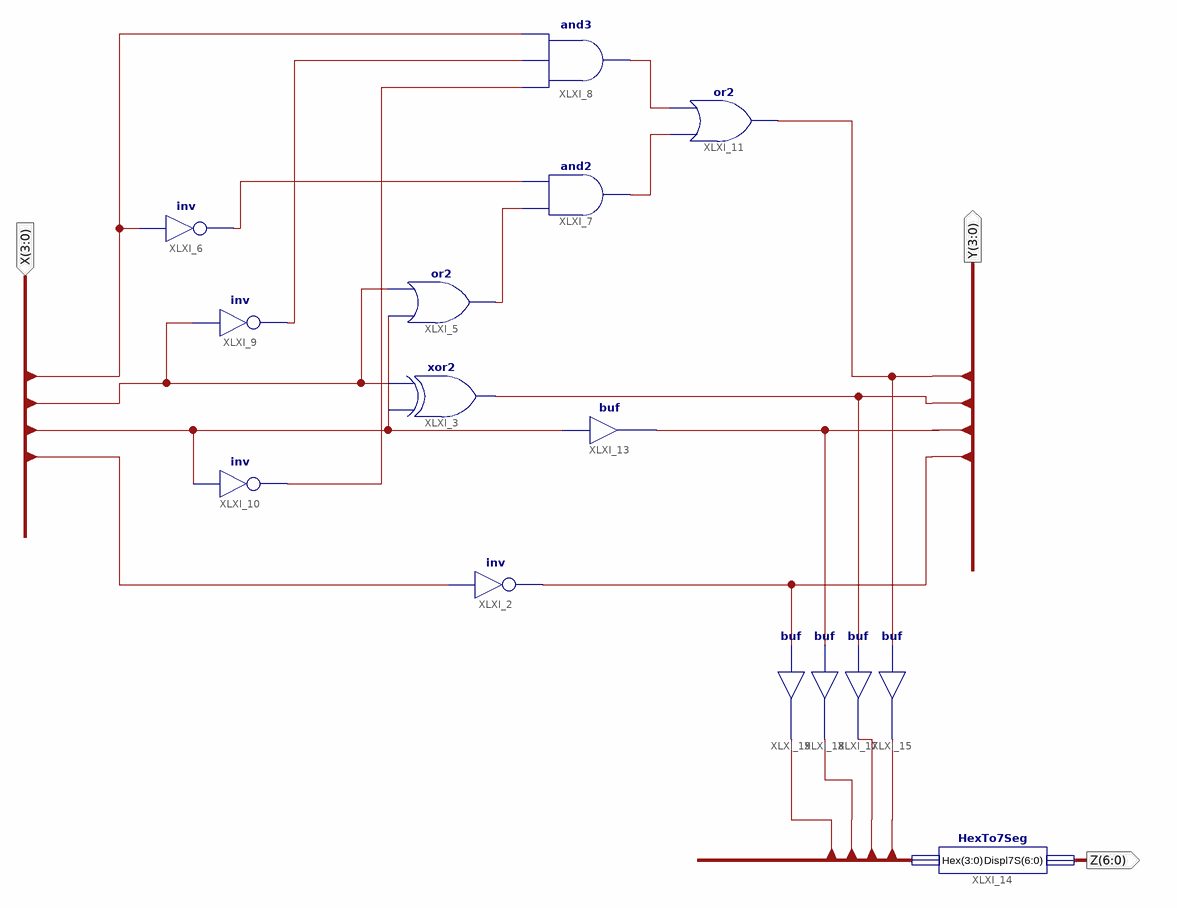
[diagram p0: schematic sheet 1]
// Xilinx ISE schematic zad2.sch (xc9500xl) as structural Verilog: 15 symbols, 3 ports
module zad2 (
  input  [3:0] X,
  output [3:0] Y,
  output [6:0] Z
);

  wire XLXN_46, XLXN_47, XLXN_57, XLXN_58, XLXN_61, XLXN_62;
  wire [3:0] Hex;

  not XLXI_2 (Y[0], X[0]);
  xor XLXI_3 (Y[2], X[1], X[2]);
  or XLXI_5 (XLXN_47, X[1], X[2]);
  not XLXI_6 (XLXN_46, X[3]);
  and XLXI_7 (XLXN_62, XLXN_47, XLXN_46);
  and XLXI_8 (XLXN_61, XLXN_58, XLXN_57, X[3]);
  not XLXI_9 (XLXN_57, X[2]);
  not XLXI_10 (XLXN_58, X[1]);
  or XLXI_11 (Y[3], XLXN_62, XLXN_61);
  buf XLXI_13 (Y[1], X[1]);
  buf XLXI_15 (Hex[3], Y[3]);
  HexTo7Seg XLXI_14 (.Hex(Hex), .Displ7S(Z));
  buf XLXI_17 (Hex[2], Y[2]);
  buf XLXI_18 (Hex[1], Y[1]);
  buf XLXI_19 (Hex[0], Y[0]);
endmodule
